# Altium schematic sheet PIC.SchDoc
size A4
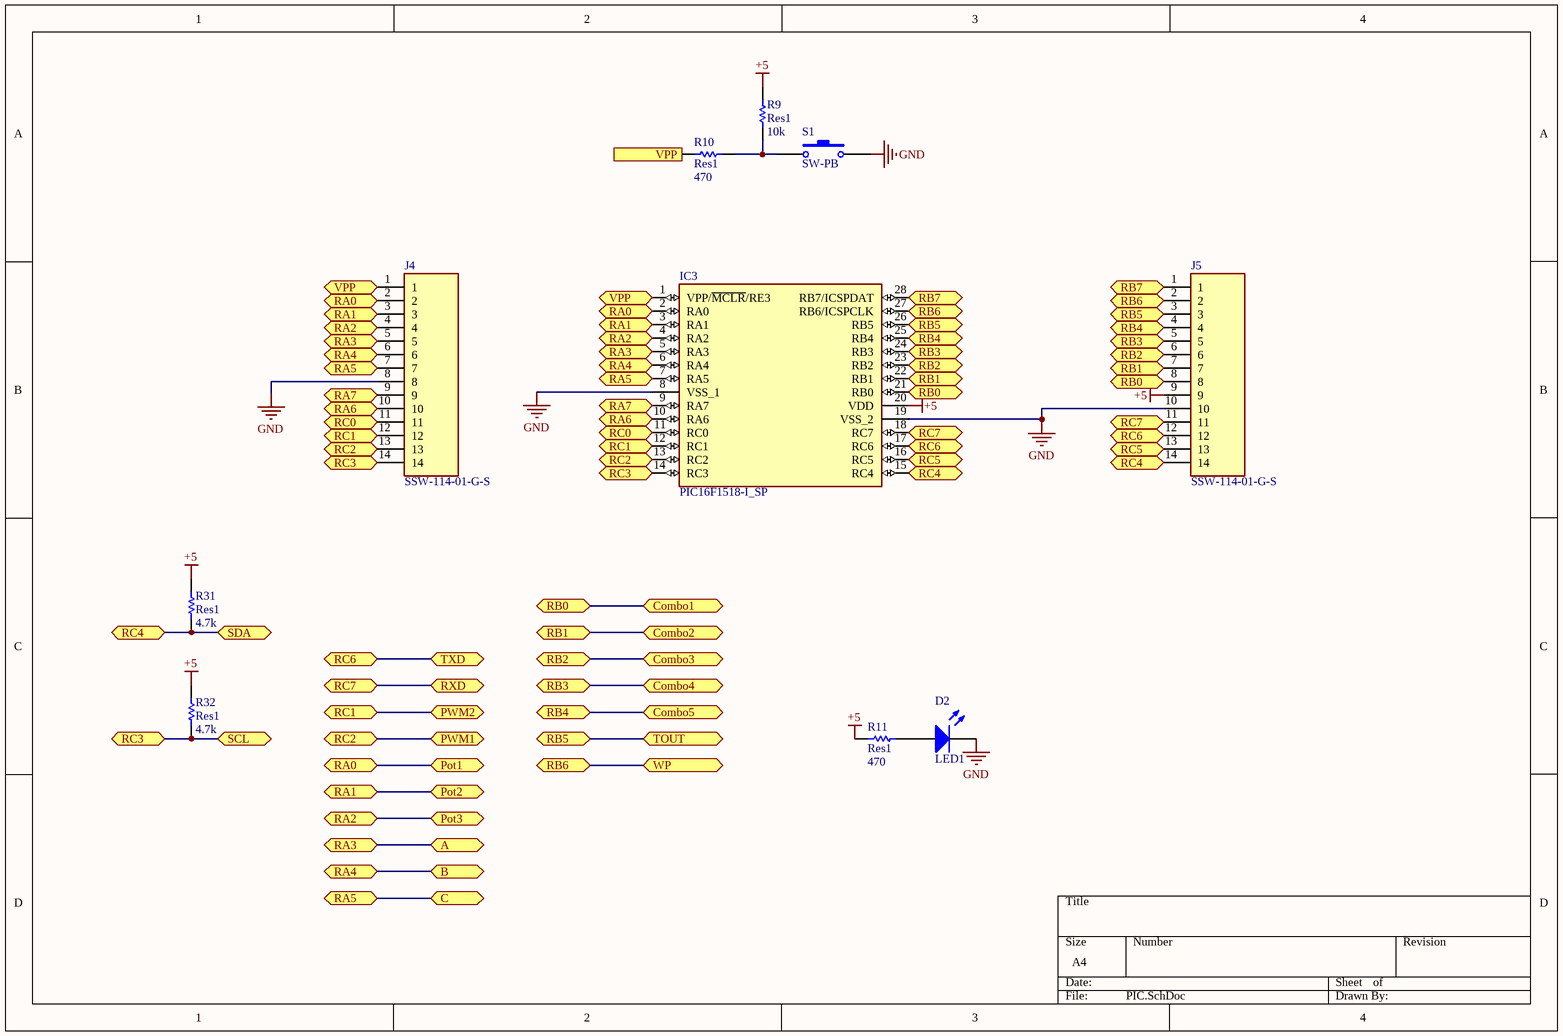
[diagram p0: PIC.SchDoc]

## Parts
D2  LED1  [LED 3mm]
IC3  PIC16F1518-I_SP  [DIP28]
J4  SSW-114-01-G-S  [Header 14 pins fem.]
J5  SSW-114-01-G-S  [Header 14 pins fem.]
R9  Res1  value 10k  [Resistor 1210]
R10  Res1  value 470  [Resistor 1210]
R11  Res1  value 470  [Resistor 1210]
R31  Res1  value 4.7k  [Resistor 1206]
R32  Res1  value 4.7k  [Resistor 1206]
S1  SW-PB  [Button]

## Ports
A (bidir), B (bidir), C (bidir), Combo1 (bidir), Combo2 (bidir), Combo3 (bidir), Combo4 (bidir), Combo5 (bidir), Pot1 (bidir), Pot2 (bidir), Pot3 (bidir), PWM1 (bidir), PWM2 (bidir), RA0 (bidir), RA1 (bidir), RA2 (bidir), RA3 (bidir), RA4 (bidir), RA5 (bidir), RA6 (bidir), RA7 (bidir), RB0 (bidir), RB1 (bidir), RB2 (bidir), RB3 (bidir), RB4 (bidir), RB5 (bidir), RB6 (bidir), RB7 (bidir), RC0 (bidir), RC1 (bidir), RC2 (bidir), RC3 (bidir), RC4 (bidir), RC5 (bidir), RC6 (bidir), RC7 (bidir), RXD (bidir), SCL (bidir), SDA (bidir), TOUT (bidir), TXD (bidir), VPP (bidir), VPP (out), WP (bidir)

## Nets
+5: IC3.20(VDD) J5.9 R9.2 R11.1 R31.2 R32.2
GND: D2.2(K) IC3.8(VSS_1) IC3.19(VSS_2) J4.8 J5.10 S1.2
A: IC3.5(RA3) J4.5 ; port RA3, port A
B: IC3.6(RA4) J4.6 ; port RA4, port B
C: IC3.7(RA5) J4.7 ; port RA5, port C
Combo1: IC3.21(RB0) J5.8 ; port RB0, port Combo1
Combo2: IC3.22(RB1) J5.7 ; port RB1, port Combo2
Combo3: IC3.23(RB2) J5.6 ; port RB2, port Combo3
Combo4: IC3.24(RB3) J5.5 ; port RB3, port Combo4
Combo5: IC3.25(RB4) J5.4 ; port RB4, port Combo5
Pot1: IC3.2(RA0) J4.2 ; port RA0, port Pot1
Pot2: IC3.3(RA1) J4.3 ; port RA1, port Pot2
Pot3: IC3.4(RA2) J4.4 ; port RA2, port Pot3
PWM1: IC3.13(RC2) J4.13 ; port RC2, port PWM1
PWM2: IC3.12(RC1) J4.12 ; port RC1, port PWM2
RA6: IC3.10(RA6) J4.10 ; port RA6
RA7: IC3.9(RA7) J4.9 ; port RA7
RB5: IC3.26(RB5) J5.3 ; port RB5, port TOUT
RB6: IC3.27(RB6/ICSPCLK) J5.2 ; port RB6, port WP
RB7: IC3.28(RB7/ICSPDAT) J5.1 ; port RB7
RC0: IC3.11(RC0) J4.11 ; port RC0
RC3: IC3.14(RC3) J4.14 R32.1 ; port RC3, port SCL
RC4: IC3.15(RC4) J5.14 R31.1 ; port RC4, port SDA
RC5: IC3.16(RC5) J5.13 ; port RC5
RC6: IC3.17(RC6) J5.12 ; port RC6, port TXD
RC7: IC3.18(RC7) J5.11 ; port RC7, port RXD
VPP: IC3.1(VPP/~{MCLR}/RE3) J4.1 R10.1 ; port VPP
NetD2_1: D2.1(A) R11.2
NetR9_1: R9.1 R10.2 S1.1

## Library data of the parts
D2 = LED1: Typical RED GaAs LED; Published: 8-Jun-2000; LatestRevisionDate: 08-Jul-2005; LatestRevisionNote: Mech Layer 1 removed.; PackageReference: LED-1; Publisher: Altium Limited; PackageDescription: LED; 2 Leads
IC3 = PIC16F1518-I_SP: Integrated Circuit; Manufacturer_Name: Microchip; Manufacturer_Part_Number: PIC16F1518-I/SP; Datasheet Link: http://ww1.microchip.com/downloads/en/DeviceDoc/40001452F.pdf; Height: 5.08mm; Arrow Part Number: PIC16F1518-I/SP; Arrow Price/Stock: https://www.arrow.com/en/products/pic16f1518-isp/microchip-technology; Mouser Part Number: 579-PIC16F1518-I/SP; Mouser Price/Stock: https://www.mouser.com/Search/Refine.aspx?Keyword=579-PIC16F1518-I%2FSP
J4 J5 = SSW-114-01-G-S: Connector; Manufacturer_Name: SAMTEC; Datasheet Link: https://eu.mouser.com/datasheet/2/527/ssw_th-1507658.pdf; Height: 8.51mm; Manufacturer_Part_Number: SSW-114-01-G-S; Arrow Part Number: SSW-114-01-G-S; Arrow Price/Stock: https://www.arrow.com/en/products/ssw-114-01-g-s/samtec; Mouser Part Number: 200-SSW11401GS; Mouser Price/Stock: https://www.mouser.co.uk/ProductDetail/Samtec/SSW-114-01-G-S?qs=FESYatJ8odJdl4aGY%2FwgtQ%3D%3D
R9-R11 R31 R32 = Res1: Resistor; Published: 8-Jun-2000; LatestRevisionDate: 17-Jul-2002; LatestRevisionNote: Re-released for DXP Platform.; PackageReference: AXIAL-0.3; Publisher: Altium Limited; PackageDescription: Axial Device, Thru-Hole; 2 Leads; 0.3 in Pin Spacing
S1 = SW-PB: Switch; Published: 24-Mar-1999; LatestRevisionDate: 17-Jul-2002; LatestRevisionNote: Re-released for DXP Platform.; PackageReference: SPST-2; Publisher: Altium Limited; PackageDescription: Switch; 2 Leads